# Altium schematic sheet ADXL278(AD22286).SchDoc
size A4
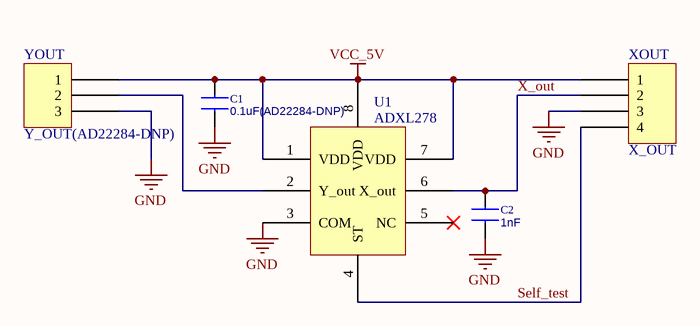
[diagram p0: ADXL278(AD22286).SchDoc]

## Parts
C1  0.1uF(AD22284-DNP)  [C_0805]
C2  1nF  [C_0805]
U1  ADXL278  [E-8-1]
XOUT  X_OUT  [4_pin_plate_conn]
YOUT  Y_OUT(AD22284-DNP)  [3_pin_plate_conn]

## Nets
GND: C1.1 C2.1 U1.3(COM) XOUT.3 YOUT.3
VCC_5V: C1.2 U1.1(VDD) U1.7(VDD) U1.8(VDD) XOUT.1 YOUT.1
Self_test: U1.4(ST) XOUT.4
X_out: C2.2 U1.6(X_out) XOUT.2
NetU1_2: U1.2(Y_out) YOUT.2

Not connected (* = marked no-connect by the designer): U1 5(NC)*

## Library data of the parts
C1 C2 = C0805: Capacitor
  C1: Value: 0.1uF(AD22284-DNP)
  C2: Value: 1nF
U1 = ADXL278: Analog devices accelerometer
XOUT = 4_pin_plate_conn
YOUT = 3_pin_plate_conn